# Altium schematic sheet VLP.SchDoc
size A3
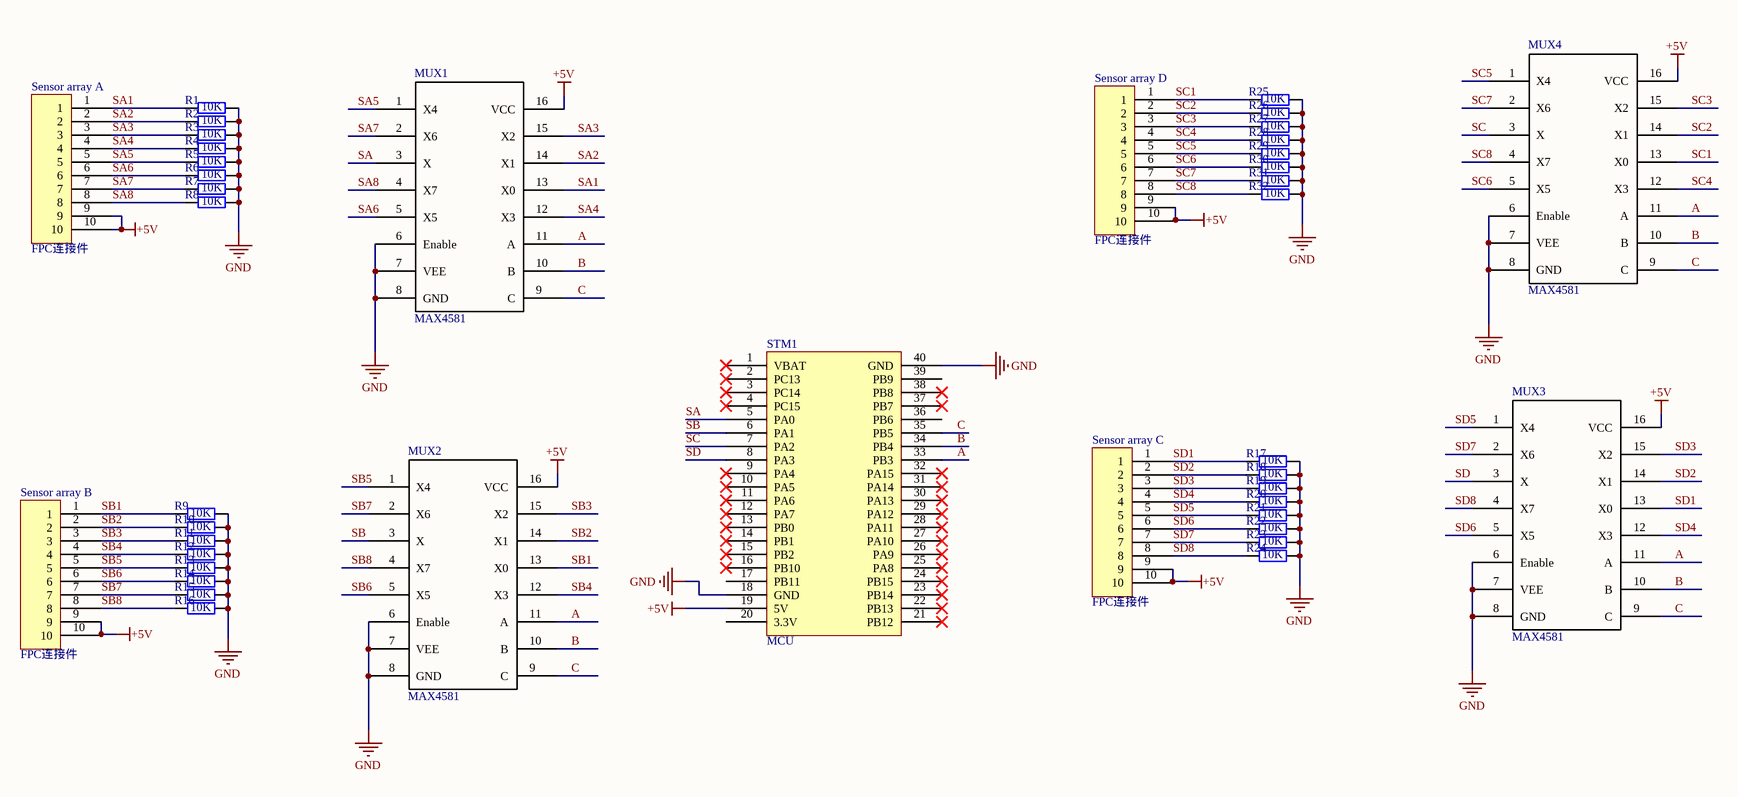
[diagram p0: VLP.SchDoc]

## Parts
MUX1  MAX4581  [MAX4581]
MUX2  MAX4581  [MAX4581]
MUX3  MAX4581  [MAX4581]
MUX4  MAX4581  [MAX4581]
R1  value 10K  [0603c]  (hidden comment: Res2)
R2  value 10K  [0603c]  (hidden comment: Res2)
R3  value 10K  [0603c]  (hidden comment: Res2)
R4  value 10K  [0603c]  (hidden comment: Res2)
R5  value 10K  [0603c]  (hidden comment: Res2)
R6  value 10K  [0603c]  (hidden comment: Res2)
R7  value 10K  [0603c]  (hidden comment: Res2)
R8  value 10K  [0603c]  (hidden comment: Res2)
R9  value 10K  [0603c]  (hidden comment: Res2)
R10  value 10K  [0603c]  (hidden comment: Res2)
R11  value 10K  [0603c]  (hidden comment: Res2)
R12  value 10K  [0603c]  (hidden comment: Res2)
R13  value 10K  [0603c]  (hidden comment: Res2)
R14  value 10K  [0603c]  (hidden comment: Res2)
R15  value 10K  [0603c]  (hidden comment: Res2)
R16  value 10K  [0603c]  (hidden comment: Res2)
R17  value 10K  [0603c]  (hidden comment: Res2)
R18  value 10K  [0603c]  (hidden comment: Res2)
R19  value 10K  [0603c]  (hidden comment: Res2)
R20  value 10K  [0603c]  (hidden comment: Res2)
R21  value 10K  [0603c]  (hidden comment: Res2)
R22  value 10K  [0603c]  (hidden comment: Res2)
R23  value 10K  [0603c]  (hidden comment: Res2)
R24  value 10K  [0603c]  (hidden comment: Res2)
R25  value 10K  [0603c]  (hidden comment: Res2)
R26  value 10K  [0603c]  (hidden comment: Res2)
R27  value 10K  [0603c]  (hidden comment: Res2)
R28  value 10K  [0603c]  (hidden comment: Res2)
R29  value 10K  [0603c]  (hidden comment: Res2)
R30  value 10K  [0603c]  (hidden comment: Res2)
R31  value 10K  [0603c]  (hidden comment: Res2)
R32  value 10K  [0603c]  (hidden comment: Res2)
Sensor_array_A  FPC连接件  [FPC连接器-10P]
Sensor_array_B  FPC连接件  [FPC连接器-10P]
Sensor_array_C  FPC连接件  [FPC连接器-10P]
Sensor_array_D  FPC连接件  [FPC连接器-10P]
STM1  MCU  [STM32F103C8T6-4]

## Nets
+5V: MUX1.16(VCC) MUX2.16(VCC) MUX3.16(VCC) MUX4.16(VCC) Sensor_array_A.9 Sensor_array_A.10 Sensor_array_B.9 Sensor_array_B.10 Sensor_array_C.9 Sensor_array_C.10 Sensor_array_D.9 Sensor_array_D.10 STM1.19(5V)
GND: MUX1.6(Enable) MUX1.7(VEE) MUX1.8(GND) MUX2.6(Enable) MUX2.7(VEE) MUX2.8(GND) MUX3.6(Enable) MUX3.7(VEE) MUX3.8(GND) MUX4.6(Enable) MUX4.7(VEE) MUX4.8(GND) R1.2 R2.2 R3.2 R4.2 R5.2 R6.2 R7.2 R8.2 R9.2 R10.2 R11.2 R12.2 R13.2 R14.2 R15.2 R16.2 R17.2 R18.2 R19.2 R20.2 R21.2 R22.2 R23.2 R24.2 R25.2 R26.2 R27.2 R28.2 R29.2 R30.2 R31.2 R32.2 STM1.18(GND) STM1.40(GND)
A: MUX1.11(A) MUX2.11(A) MUX3.11(A) MUX4.11(A) STM1.33(PB3)
B: MUX1.10(B) MUX2.10(B) MUX3.10(B) MUX4.10(B) STM1.34(PB4)
C: MUX1.9(C) MUX2.9(C) MUX3.9(C) MUX4.9(C) STM1.35(PB5)
SA: MUX1.3(X) STM1.5(PA0)
SA1: MUX1.13(X0) R1.1 Sensor_array_A.1
SA2: MUX1.14(X1) R2.1 Sensor_array_A.2
SA3: MUX1.15(X2) R3.1 Sensor_array_A.3
SA4: MUX1.12(X3) R4.1 Sensor_array_A.4
SA5: MUX1.1(X4) R5.1 Sensor_array_A.5
SA6: MUX1.5(X5) R6.1 Sensor_array_A.6
SA7: MUX1.2(X6) R7.1 Sensor_array_A.7
SA8: MUX1.4(X7) R8.1 Sensor_array_A.8
SB: MUX2.3(X) STM1.6(PA1)
SB1: MUX2.13(X0) R9.1 Sensor_array_B.1
SB2: MUX2.14(X1) R10.1 Sensor_array_B.2
SB3: MUX2.15(X2) R11.1 Sensor_array_B.3
SB4: MUX2.12(X3) R12.1 Sensor_array_B.4
SB5: MUX2.1(X4) R13.1 Sensor_array_B.5
SB6: MUX2.5(X5) R14.1 Sensor_array_B.6
SB7: MUX2.2(X6) R15.1 Sensor_array_B.7
SB8: MUX2.4(X7) R16.1 Sensor_array_B.8
SC: MUX4.3(X) STM1.7(PA2)
SC1: MUX4.13(X0) R25.1 Sensor_array_D.1
SC2: MUX4.14(X1) R26.1 Sensor_array_D.2
SC3: MUX4.15(X2) R27.1 Sensor_array_D.3
SC4: MUX4.12(X3) R28.1 Sensor_array_D.4
SC5: MUX4.1(X4) R29.1 Sensor_array_D.5
SC6: MUX4.5(X5) R30.1 Sensor_array_D.6
SC7: MUX4.2(X6) R31.1 Sensor_array_D.7
SC8: MUX4.4(X7) R32.1 Sensor_array_D.8
SD: MUX3.3(X) STM1.8(PA3)
SD1: MUX3.13(X0) R17.1 Sensor_array_C.1
SD2: MUX3.14(X1) R18.1 Sensor_array_C.2
SD3: MUX3.15(X2) R19.1 Sensor_array_C.3
SD4: MUX3.12(X3) R20.1 Sensor_array_C.4
SD5: MUX3.1(X4) R21.1 Sensor_array_C.5
SD6: MUX3.5(X5) R22.1 Sensor_array_C.6
SD7: MUX3.2(X6) R23.1 Sensor_array_C.7
SD8: MUX3.4(X7) R24.1 Sensor_array_C.8

Not connected (* = marked no-connect by the designer): STM1 1(VBAT)* 2(PC13)* 3(PC14)* 4(PC15)* 9(PA4)* 10(PA5)* 11(PA6)* 12(PA7)* 13(PB0)* 14(PB1)* 15(PB2)* 16(PB10)* 17(PB11) 20(3.3V) 21(PB12)* 22(PB13)* 23(PB14)* 24(PB15)* 25(PA8)* 26(PA9)* 27(PA10)* 28(PA11)* 29(PA12)* 30(PA13)* 31(PA14)* 32(PA15)* 36(PB6) 37(PB7)* 38(PB8)* 39(PB9)

## Library data of the parts
R1-R32 = Res2: Resistor; Published: 8-Jun-2000; LatestRevisionDate: 17-Jul-2002; LatestRevisionNote: Re-released for DXP Platform.; PackageReference: AXIAL-0.4; Publisher: Altium Limited; PackageDescription: Axial Device, Thru-Hole; 2 Leads; 0.4 in Pin Spacing
STM1 = Component_1
MUX1-MUX4 = MAX4581: MUX: MAX4581